# EAGLE schematic digital.noise.gen (EAGLE 7.5.0)
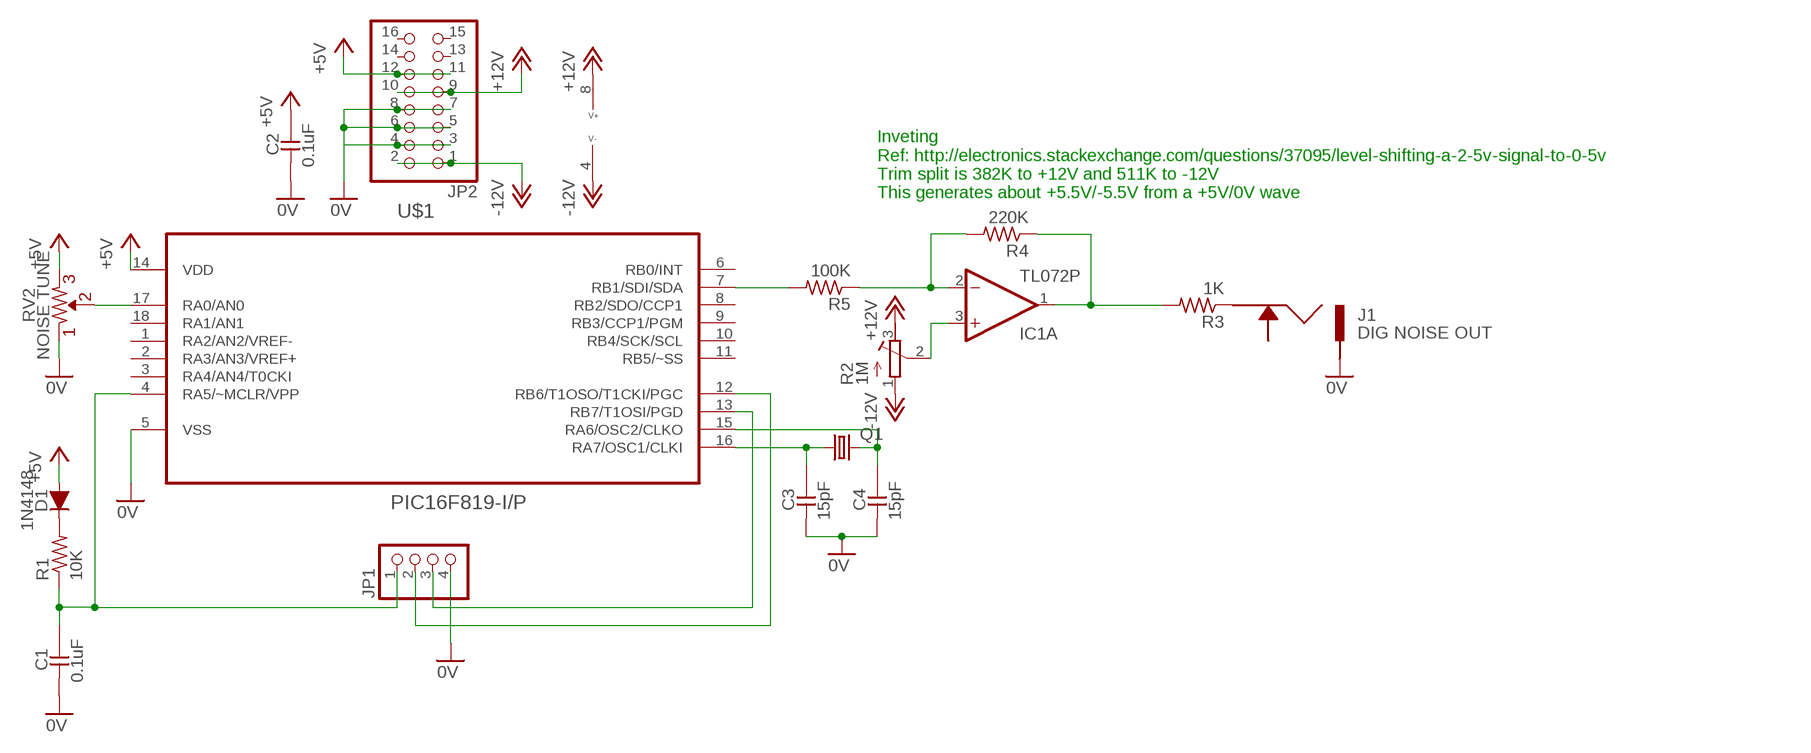
[diagram p0: schematic, sheet 1]

## Parts
C1  0.1uF  CC-US025-024X044  [C025-024X044]
C2  0.1uF  CC-US025-024X044  [C025-024X044]
C3  15pF  CC-US025-024X044  [C025-024X044]
C4  15pF  CC-US025-024X044  [C025-024X044]
D1  1N4148  [DO35-7]
IC1  TL072P  [DIL08]
J1  DIG NOISE OUT  ACJM-MV35-2S  [ACJM-MV35-2S]
JP1  PINHD-1X4  [1X04]
JP2  PINHD-2X8  [2X08]
Q1  CRYSTALHC49S  [HC49/S]
R1  10K  R-US_0207/7  [0207/7]
R2  1M  R-TRIMM3339P  [RTRIM3339P]
R3  1K  R-US_0207/7  [0207/7]
R4  220K  R-US_0207/7  [0207/7]
R5  100K  R-US_0207/7  [0207/7]
RV2  NOISE TUNE  R-VAR  [R-VAR]
U$1  PIC16F819-I/P  [DIP254P762X432-18]

## Nets
0V: C1.2 C2.2 C3.2 C4.2 J1.P$1 JP1.4 JP2.3 JP2.4 JP2.5 JP2.6 JP2.7 JP2.8 RV2.R1 U$1.5(VSS)
+5V: C2.1 D1.A JP2.11 JP2.12 RV2.R2 U$1.14(VDD)
+12V: IC1.8(P:V+) JP2.9 JP2.10 R2.3(E)
-12V: IC1.4(P:V-) JP2.1 JP2.2 R2.1(A)
N$1: C1.1 JP1.1 R1.1 U$1.4(RA5/~MCLR/VPP)
N$2: JP1.2 U$1.12(RB6/T1OSO/T1CKI/PGC)
N$3: JP1.3 U$1.13(RB7/T1OSI/PGD)
N$4: D1.C R1.2
N$5: C3.1 Q1.1 U$1.16(RA7/OSC1/CLKI)
N$6: J1.P$3 R3.1
N$7: C4.1 Q1.2 U$1.15(RA6/OSC2/CLKO)
N$8: RV2.VAR U$1.17(RA0/AN0)
N$13: R5.2 U$1.7(RB1/SDI/SDA)
N$14: IC1.2(A:-IN) R4.2 R5.1
N$15: IC1.3(A:+IN) R2.2(S)
N$16: IC1.1(A:OUT) R3.2 R4.1
Unconnected: IC1.5(B:+IN) IC1.6(B:-IN) IC1.7(B:OUT) J1.P$2 JP2.13 JP2.14 JP2.15 JP2.16 U$1.1(RA2/AN2/VREF-) U$1.2(RA3/AN3/VREF+) U$1.3(RA4/AN4/T0CKI) U$1.6(RB0/INT) U$1.8(RB2/SDO/CCP1) U$1.9(RB3/CCP1/PGM) U$1.10(RB4/SCK/SCL) U$1.11(RB5/~SS) U$1.18(RA1/AN1)

## Notes on the sheet
- Inveting
  Ref: http://electronics.stackexchange.com/questions/37095/level-shifting-a-2-5v-signal-to-0-5v
  Trim split is 382K to +12V and 511K to -12V
  This generates about +5.5V/-5.5V from a +5V/0V wave

## Library data of the parts
C1-C4 = _common:CC-US: CAPACITOR, US symbol
D1 = _common:1N4148: DIODE high speed (Philips)
IC1 = _common:TL072: OP AMP
J1 = jacks:ACJM-MV35-2S: Amphenol 3.5mm Jack (Vertical) ACJM-MV35-2S http://ca.mouser.com/Search/ProductDetail.aspx?R=ACJM-MV35-2Svirtualkey52380000virtualkey523-ACJMMV352S
JP1 = pinhead:PINHD-1X4: PIN HEADER
JP2 = pinhead:PINHD-2X8: PIN HEADER
Q1 = crystal:CRYSTAL: CRYSTAL; OC_FARNELL: 1667008; OC_NEWARK: unknown
R1 R3-R5 = _common:R-US_: RESISTOR, American symbol
R2 = resistor:R-TRIMM: Trimm resistor
RV2 = _common:R-VAR
U$1 = Microchip_By_element14_Batch_1:PIC16F819-I/P: Flash Microcontrollers; MPN: PIC16F819-I/P; OC_FARNELL: 9760784; OC_NEWARK: 89C2861; PACKAGE: DIP-18; SUPPLIER: Microchip